# Altium project AnalogHeart.PrjPcb
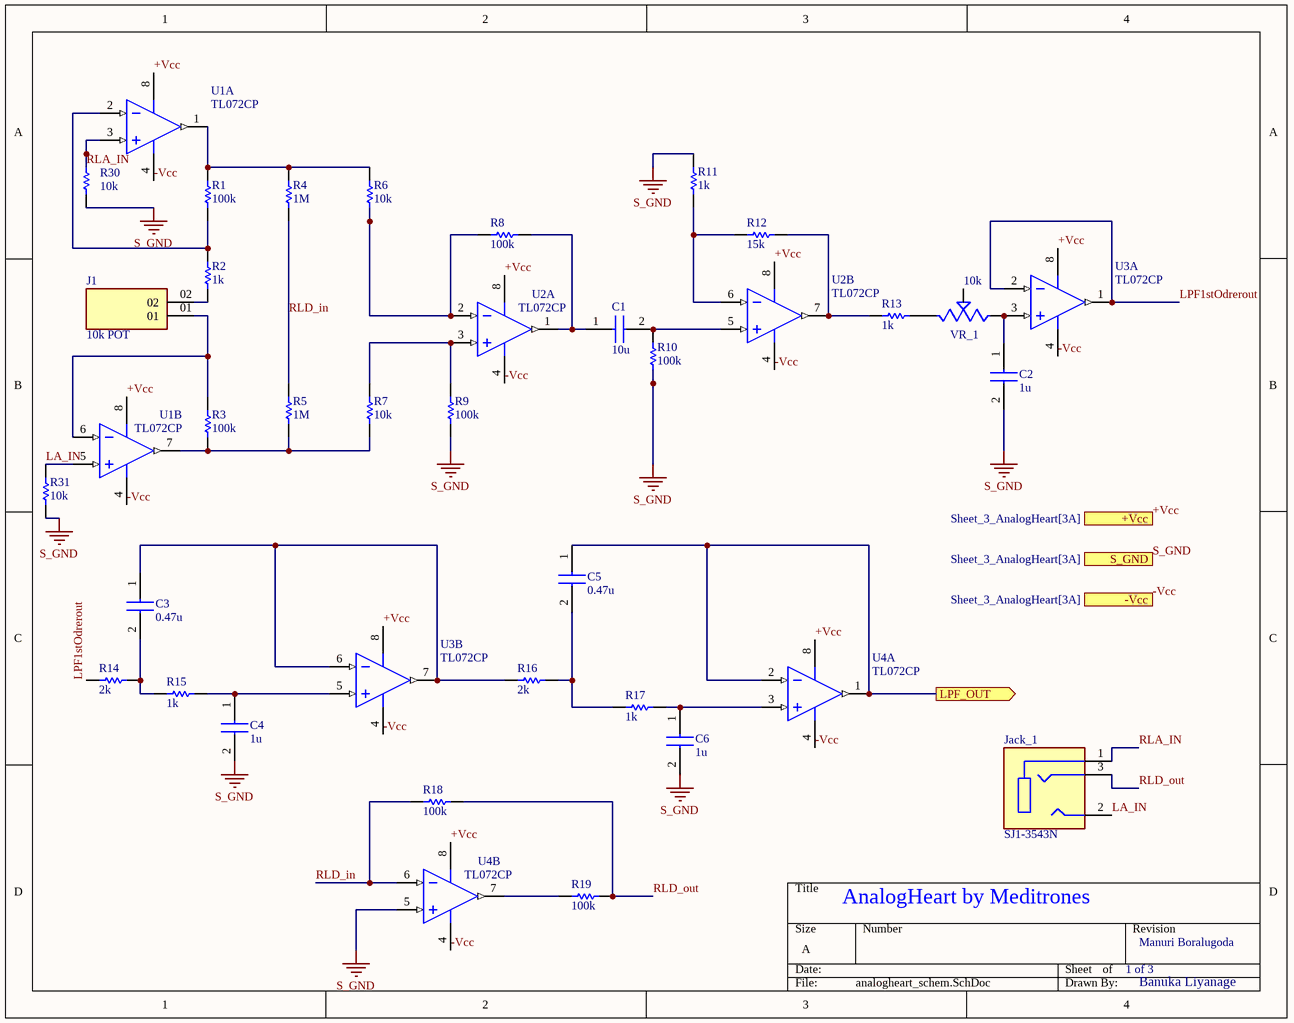
[diagram p0: analogheart_schem.SchDoc]
3 sheets, 72 parts. Net scope: flat (ports and power ports of the same name join across sheets).
Sheets:
  analogheart_schem.SchDoc
  sheet_2_AnalogHeart.SchDoc
  Sheet_3_AnalogHeart.SchDoc

## Sheet analogheart_schem.SchDoc
size A; SheetNumber: 1; SheetTotal: 3

### Parts
C1  10u  [CAPC2012X94N]
C2  1u  [CAPC2012X94N]
C3  0.47u  [CAPC2012X94N]
C4  1u  [CAPC2012X94N]
C5  0.47u  [CAPC2012X94N]
C6  1u  [CAPC2012X94N]
J1  10k POT  [SAMTEC_MTSW-102-11-T-S-640]
Jack_1  SJ1-3543N  [CUI_SJ1-3543N]
R1  100k  [RESC2013X50X30NL20T20]
R2  1k  [RESC2013X50X30NL20T20]
R3  100k  [RESC2013X50X30NL20T20]
R4  1M  [RESC2013X50X30NL20T20]
R5  1M  [RESC2013X50X30NL20T20]
R6  10k  [RESC2013X50X30NL20T20]
R7  10k  [RESC2013X50X30NL20T20]
R8  100k  [RESC2013X50X30NL20T20]
R9  100k  [RESC2013X50X30NL20T20]
R10  100k  [RESC2013X50X30NL20T20]
R11  1k  [RESC2013X50X30NL20T20]
R12  15k  [RESC2013X50X30NL20T20]
R13  1k  [RESC2013X50X30NL20T20]
R14  2k  [RESC2013X50X30NL20T20]
R15  1k  [RESC2013X50X30NL20T20]
R16  2k  [RESC2013X50X30NL20T20]
R17  1k  [RESC2013X50X30NL20T20]
R18  100k  [RESC2013X50X30NL20T20]
R19  100k  [RESC2013X50X30NL20T20]
R30  10k  [RESC2013X50X30NL20T20]
R31  10k  [RESC2013X50X30NL20T20]
U1  TL072CP  [P0008A]  (parts A,B of 2)
U2  TL072CP  [P0008A]  (parts A,B of 2)
U3  TL072CP  [P0008A]  (parts A,B of 2)
U4  TL072CP  [P0008A]  (parts A,B of 2)
VR_1  10k  [TRIM_3386F-1-103TLF]

### Ports
+Vcc (in, see Sheet_3_AnalogHeart[3A]), -Vcc (in, see Sheet_3_AnalogHeart[3A]), LPF_OUT (out, see sheet_2_AnalogHeart[1C]), S_GND (in, see Sheet_3_AnalogHeart[3A])

### Nets
S_GND: C2.2 C4.2 C6.2 R9.1 R10.1 R11.2 R30.2 R31.2 U4.5(IN2+) ; port S_GND
+Vcc: U1.8(VCC+) U2.8(VCC+) U3.8(VCC+) U4.8(VCC+) ; port +Vcc
-Vcc: U1.4(VCC-) U2.4(VCC-) U3.4(VCC-) U4.4(VCC-) ; port -Vcc
LA_IN: Jack_1.2 R31.1 U1.5(IN2+)
LPF1stOdrerout: R14.2 U3.1(OUT1) U3.2(IN1-)
RLA_IN: Jack_1.1 R30.1 U1.3(IN1+)
RLD_in: R4.1 R5.2 R18.2 U4.6(IN2-)
RLD_out: Jack_1.3 R18.1 R19.1
NetC1_1: C1.1 R8.2 U2.1(OUT1)
NetC1_2: C1.2 R10.2 U2.5(IN2+)
NetC2_1: C2.1 U3.3(IN1+) VR_1.1(CCW)
NetC3_1: C3.1 R16.2 U3.6(IN2-) U3.7(OUT2)
NetC3_2: C3.2 R14.1 R15.2
NetC4_1: C4.1 R15.1 U3.5(IN2+)
NetC5_1: C5.1 U4.1(OUT1) U4.2(IN1-) ; port LPF_OUT
NetC5_2: C5.2 R16.1 R17.2
NetC6_1: C6.1 R17.1 U4.3(IN1+)
NetJ1_01: J1.01 R3.2 U1.6(IN2-)
NetJ1_02: J1.02 R2.1
NetR1_1: R1.1 R2.2 U1.2(IN1-)
NetR1_2: R1.2 R4.2 R6.2 U1.1(OUT1)
NetR3_1: R3.1 R5.1 R7.1 U1.7(OUT2)
NetR6_1: R6.1 R8.1 U2.2(IN1-)
NetR7_2: R7.2 R9.2 U2.3(IN1+)
NetR11_1: R11.1 R12.2 U2.6(IN2-)
NetR12_1: R12.1 R13.2 U2.7(OUT2)
NetR13_1: R13.1 VR_1.3(CW)
NetR19_2: R19.2 U4.7(OUT2)

Not connected (* = marked no-connect by the designer): VR_1 2(WIPER)

### Notes on the sheet
- AnalogHeart by Meditrones
- 1 of 3
- Manuri Boralugoda
- Banuka Liyanage

### Library data of the parts
C1-C6 = 08055A331FAT2A: Capacitor; Manufacturer_Name: Kyocera AVX; Datasheet Link: https://componentsearchengine.com/Datasheets/1/06031A100FAT2A.pdf; Height: 0.94mm; Manufacturer_Part_Number: 08055A331FAT2A; Mouser Part Number: 581-08055A331FAT2A; Mouser Price/Stock: https://www.mouser.com/Search/Refine.aspx?Keyword=581-08055A331FAT2A; Arrow Part Number: 08055A331FAT2A; Arrow Price/Stock: https://www.arrow.com/en/products/08055a331fat2a/avx
J1 = MTSW-102-11-T-S-640: Package: None; Price: None; MP: MTSW-102-11-T-S-640; Availability: Unavailable; Value: *
Jack_1 = SJ1-3543N: MF: {'manufacturer': u'CUI'}; Package: None; Price: None; Value: *; MP: SJ1-3543N; Availability: Unavailable
R1-R19 R30 R31 = CMP-2001-04915-1: Manufacturer: Vishay Dale; Part Number: CRCW080510R0FKEA
U1-U4 = CMP-0017-00950-2: Dual Low-Noise JFET-Input General-Purpose Operational Amplifier, 7 to 36 V, 0 to 70 degC, 8-pin DIP (P8), Pb-Free (RoHS); Manufacturer: Texas Instruments; Sub Family: General Purpose Amplifier, High Supply Voltage Amplifier (>=30V); Total Supply Voltage(Max)(+5V is 5, +/-5V is 10): 36; Slew Rate(Typ)(V/us): 13; Vn at 1kHz(Typ)(nV/rtHz): 18; GBW(Typ)(MHz): 3; CMRR(Min)(dB): 70; Total Supply Voltage(Min)(+5V is 5, +/-5V is 10): 7; Vio (25C)(Max)(mV): 10; Rating: Catalog; IIB(Max)(pA): 200; Iq per channel(Max)(mA): 2.5; Number of Channels: 2; Mounting Technology: Through Hole; ComponentLink3Description: Package Specification; PartNumber: TL072CP; PackageVersion: 4040082/E, 04/2010; Eco-Plan: Pb-Free (RoHS); DatasheetVersion: SLOS080J; Offset Drift(Typ)(uV/C): 18; ComponentLink3URL: http://www.ti.com/litv/pdf/mpdi001b; PackageDescription: 8-Pin Plastic In-Line, Body 9.59 x 6.35 mm, Pitch 2.54 mm; Code_JEDEC: MS-001; ComponentLink2URL: http://www.ti.com/lit/ds/symlink/tl072.pdf; ComponentLink1Description: Manufacturer URL; ComponentLink2Description: Datasheet; ComponentLink1URL: http://www.ti.com/; PackageReference: P0008A
VR_1 = 3386F-1-103TLF: 10 kOhms 0.5W, 1/2W PC Pins Through Hole Trimmer Potentiometer Cermet 1.0 Turn Top Finger Adjustment; MF: Bourns; Package: 3386F-3 Bourns; Price: None; Check_prices: https://www.snapeda.com/parts/3386F-1-103TLF/Bourns/view-part/?ref=eda; Value: *; SnapEDA_Link: https://www.snapeda.com/parts/3386F-1-103TLF/Bourns/view-part/?ref=snap; MP: 3386F-1-103TLF; Availability: In Stock; Purchase-URL: https://pricing.snapeda.com/search/part/3386F-1-103TLF/?ref=eda

## Sheet sheet_2_AnalogHeart.SchDoc
size A; SheetNumber: 2; SheetTotal: 3
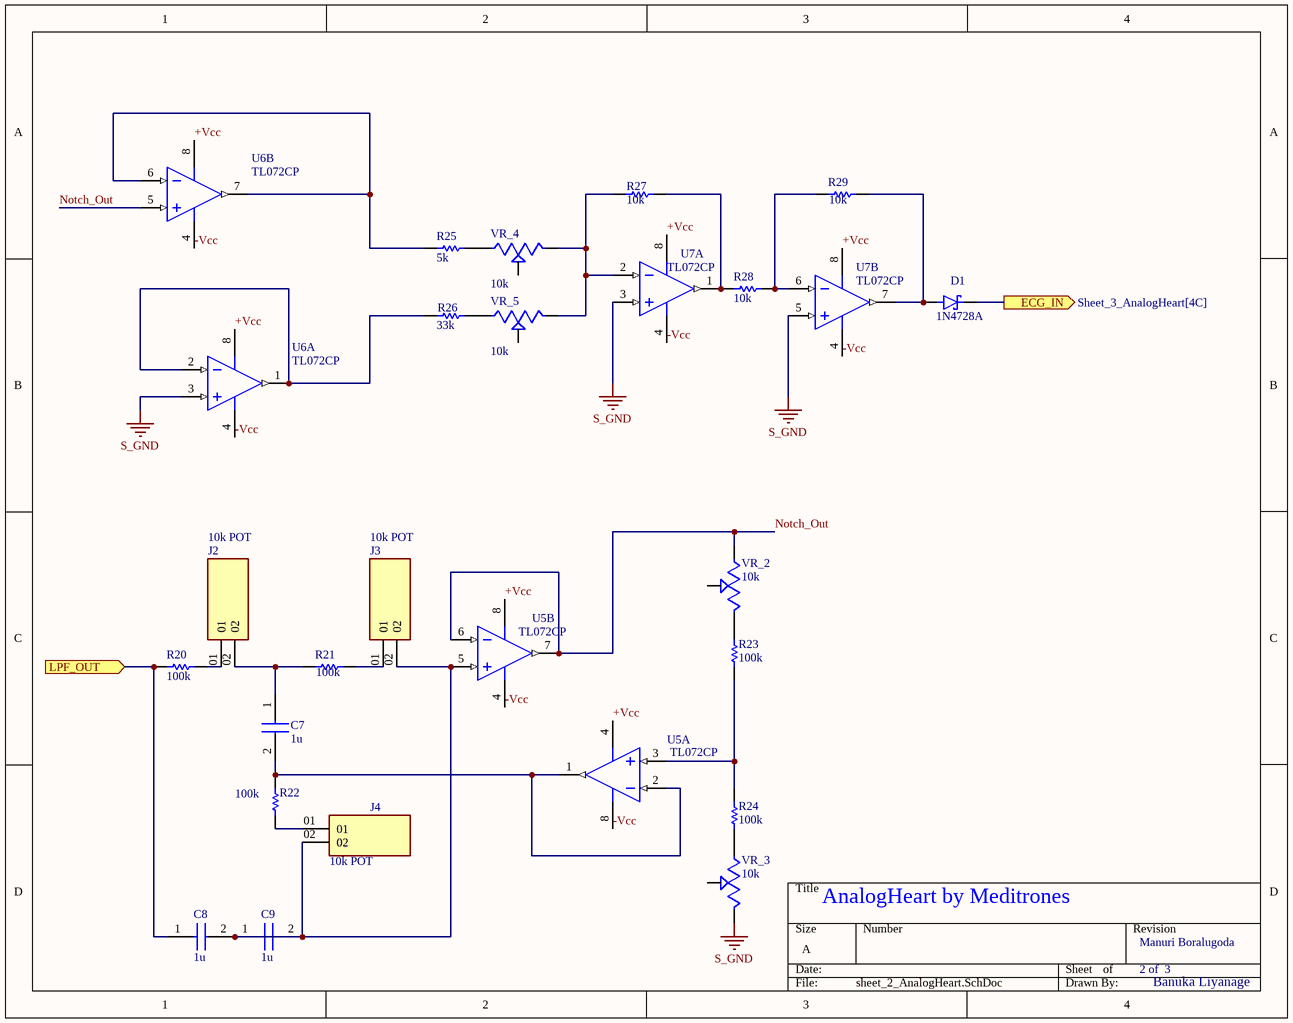
[diagram p1: sheet_2_AnalogHeart.SchDoc]

### Parts
C7  1u  [CAPC2012X94N]
C8  1u  [CAPC2012X94N]
C9  1u  [CAPC2012X94N]
D1  1N4728A  [DIOAD1036W78L463D272]
J2  10k POT  [SAMTEC_MTSW-102-11-T-S-640]
J3  10k POT  [SAMTEC_MTSW-102-11-T-S-640]
J4  10k POT  [SAMTEC_MTSW-102-11-T-S-640]
R20  100k  [RESC2013X50X30NL20T20]
R21  100k  [RESC2013X50X30NL20T20]
R22  100k  [RESC2013X50X30NL20T20]
R23  100k  [RESC2013X50X30NL20T20]
R24  100k  [RESC2013X50X30NL20T20]
R25  5k  [RESC2013X50X30NL20T20]
R26  33k  [RESC2013X50X30NL20T20]
R27  10k  [RESC2013X50X30NL20T20]
R28  10k  [RESC2013X50X30NL20T20]
R29  10k  [RESC2013X50X30NL20T20]
U5  TL072CP  [P0008A]  (parts A,B of 2)
U6  TL072CP  [P0008A]  (parts A,B of 2)
U7  TL072CP  [P0008A]  (parts A,B of 2)
VR_2  10k  [TRIM_3386F-1-103TLF]
VR_3  10k  [TRIM_3386F-1-103TLF]
VR_4  10k  [TRIM_3386F-1-103TLF]
VR_5  10k  [TRIM_3386F-1-103TLF]

### Ports
ECG_IN (out, see Sheet_3_AnalogHeart[4C]), LPF_OUT (in, see analogheart_schem[3C])

### Nets
S_GND: U6.3(IN1+) U7.3(IN1+) U7.5(IN2+) VR_3.3(CW)
+Vcc: U5.4(VCC-) U5.8(VCC+) U6.8(VCC+) U7.8(VCC+)
-Vcc: U5.4(VCC-) U5.8(VCC+) U6.4(VCC-) U7.4(VCC-)
Notch_Out: U5.6(IN2-) U5.7(OUT2) U6.5(IN2+) VR_2.1(CCW)
NetC5_1: C8.1 R20.2 ; port LPF_OUT
NetC7_1: C7.1 J2.02 R21.2
NetC7_2: C7.2 R22.1 U5.1(OUT1) U5.2(IN1-)
NetC8_2: C8.2 C9.1 C9.2 J3.02 J4.02 U5.5(IN2+)
NetD1_1: D1.1(K) ; port ECG_IN
NetD1_2: D1.2(A) R29.1 U7.7(OUT2)
NetJ2_01: J2.01 R20.1
NetJ3_01: J3.01 R21.1
NetJ4_01: J4.01 R22.2
NetR23_1: R23.1 VR_2.3(CW)
NetR23_2: R23.2 R24.1 U5.3(IN1+)
NetR24_2: R24.2 VR_3.1(CCW)
NetR25_1: R25.1 VR_4.1(CCW)
NetR25_2: R25.2 U6.6(IN2-) U6.7(OUT2)
NetR26_1: R26.1 VR_5.1(CCW)
NetR26_2: R26.2 U6.1(OUT1) U6.2(IN1-)
NetR27_1: R27.1 R28.2 U7.1(OUT1)
NetR27_2: R27.2 U7.2(IN1-) VR_4.3(CW) VR_5.3(CW)
NetR28_1: R28.1 R29.2 U7.6(IN2-)

Not connected (* = marked no-connect by the designer): VR_2 2(WIPER); VR_3 2(WIPER); VR_4 2(WIPER); VR_5 2(WIPER)

### Notes on the sheet
- AnalogHeart by Meditrones
- 2 of  3
- Manuri Boralugoda
- Banuka Liyanage

### Library data of the parts
C7-C9 = 08055A331FAT2A: as C1 on sheet analogheart_schem; Datasheet Link: https://componentsearchengine.com/Datasheets/1/06031A100FAT2A.pdf; Height: 0.94mm; Manufacturer_Part_Number: 08055A331FAT2A; Mouser Part Number: 581-08055A331FAT2A; Mouser Price/Stock: https://www.mouser.com/Search/Refine.aspx?Keyword=581-08055A331FAT2A; Arrow Part Number: 08055A331FAT2A; Arrow Price/Stock: https://www.arrow.com/en/products/08055a331fat2a/avx
D1 = 1N4728A: Ð¡Ñ‚Ð°Ð±Ð¸Ð»Ð¸Ñ‚Ñ€Ð¾Ð½ 3,3 Ð’ 1 Ð’Ñ‚ Â± 5% ÑÐ¾ ÑÐºÐ²Ð¾Ð·Ð½Ñ‹Ð¼ Ð¾Ñ‚Ð²ÐµÑ€ÑÑ‚Ð¸ÐµÐ¼ DO-41; MF: ON Semiconductor; SnapEDA_Link: https://www.snapeda.com/parts/1N4728A/Onsemi/view-part/?ref=snap; Package: DO-41 ON Semiconductor; Value: *; MP: 1N4728A; Check_prices: https://www.snapeda.com/parts/1N4728A/Onsemi/view-part/?ref=eda
J2-J4 = MTSW-102-11-T-S-640: Package: None; Price: None; MP: MTSW-102-11-T-S-640; Availability: Unavailable; Value: *
R20-R29 = CMP-2001-04915-1: as R1 on sheet analogheart_schem
U5-U7 = CMP-0017-00950-2: as U1 on sheet analogheart_schem; Mounting Technology: Through Hole; ComponentLink3Description: Package Specification; PartNumber: TL072CP; PackageVersion: 4040082/E, 04/2010; Eco-Plan: Pb-Free (RoHS); DatasheetVersion: SLOS080J; Offset Drift(Typ)(uV/C): 18; ComponentLink3URL: http://www.ti.com/litv/pdf/mpdi001b; PackageDescription: 8-Pin Plastic In-Line, Body 9.59 x 6.35 mm, Pitch 2.54 mm; Code_JEDEC: MS-001; ComponentLink2URL: http://www.ti.com/lit/ds/symlink/tl072.pdf; ComponentLink1Description: Manufacturer URL; ComponentLink2Description: Datasheet; ComponentLink1URL: http://www.ti.com/; PackageReference: P0008A
VR_2-VR_5 = 3386F-1-103TLF: as VR_1 on sheet analogheart_schem; Package: 3386F-3 Bourns; Price: None; Check_prices: https://www.snapeda.com/parts/3386F-1-103TLF/Bourns/view-part/?ref=eda; Value: *; SnapEDA_Link: https://www.snapeda.com/parts/3386F-1-103TLF/Bourns/view-part/?ref=snap; MP: 3386F-1-103TLF; Availability: In Stock; Purchase-URL: https://pricing.snapeda.com/search/part/3386F-1-103TLF/?ref=eda

## Sheet Sheet_3_AnalogHeart.SchDoc
size A; SheetNumber: 3; SheetTotal: 3
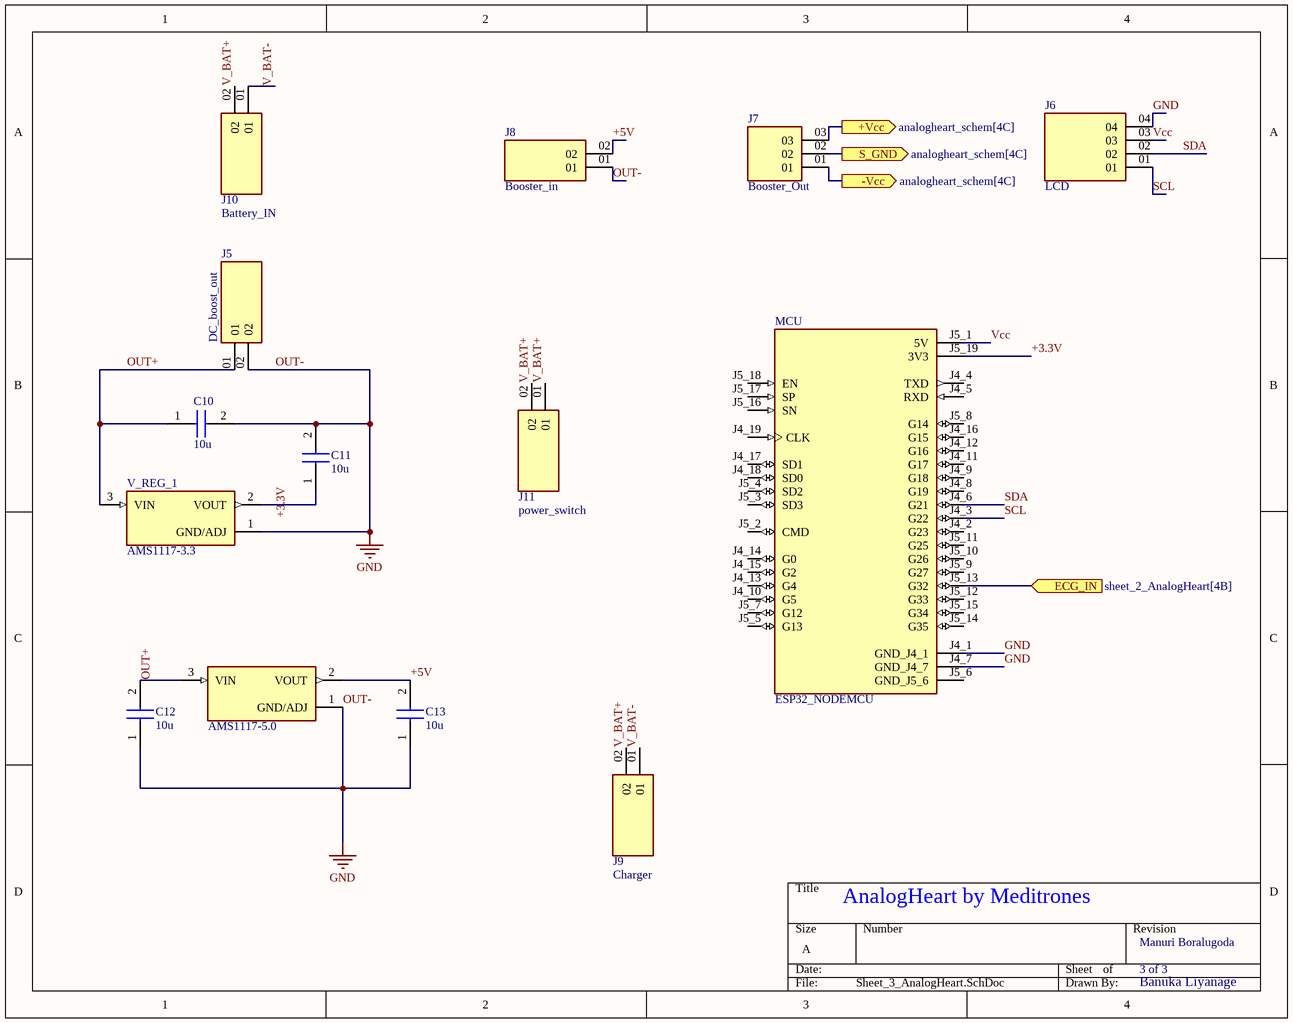
[diagram p2: Sheet_3_AnalogHeart.SchDoc]

### Parts
?  AMS1117-5.0  [SOT229P700X180-4N]
C10  10u  [CAPC2012X94N]
C11  10u  [CAPC2012X94N]
C12  10u  [CAPC2012X94N]
C13  10u  [CAPC2012X94N]
J5  DC_boost_out  [SAMTEC_MTSW-102-11-T-S-640]
J6  LCD  [SAMTEC_MTSW-104-08-G-S-350]
J7  Booster_Out  [SAMTEC_MTLW-103-XX-XX-S-XXX]
J8  Booster_in  [SAMTEC_MTSW-102-11-T-S-640]
J9  Charger  [SAMTEC_MTSW-102-11-T-S-640]
J10  Battery_IN  [SAMTEC_MTSW-102-11-T-S-640]
J11  power_switch  [SAMTEC_MTSW-102-11-T-S-640]
MCU  ESP32_NODEMCU  [MODULE_ESP32_NODEMCU]
V_REG_1  AMS1117-3.3  [SOT229P700X180-4N]

### Ports
+Vcc (out, see analogheart_schem[4C]), -Vcc (out, see analogheart_schem[4C]), ECG_IN (in, see sheet_2_AnalogHeart[4B]), S_GND (out, see analogheart_schem[4C])

### Nets
GND: ?.1(GND/ADJ) C10.2 C11.2 C12.1 C13.1 J5.02 J6.04 J8.01 MCU.J4_1(GND_J4_1) MCU.J4_7(GND_J4_7) V_REG_1.1(GND/ADJ)  [also labelled OUT-]
S_GND: J7.02 ; port S_GND
+3.3V: MCU.J5_19(3V3)
+5V: ?.2(VOUT) C13.2 J8.02
+Vcc: J7.03 ; port +Vcc
-Vcc: J7.01 ; port -Vcc
OUT+: ?.3(VIN) C10.1 C12.2 J5.01 V_REG_1.3(VIN)
SCL: J6.01 MCU.J4_3(G22)
SDA: J6.02 MCU.J4_6(G21)
V_BAT+: J9.02 J10.02 J11.01 J11.02
V_BAT-: J9.01 J10.01
Vcc: J6.03 MCU.J5_1(5V)
NetC11_1: C11.1 V_REG_1.2(VOUT)
NetD1_1: MCU.J5_13(G32) ; port ECG_IN

Not connected (* = marked no-connect by the designer): MCU J4_2(G23) J4_4(TXD) J4_5(RXD) J4_8(G19) J4_9(G18) J4_10(G5) J4_11(G17) J4_12(G16) J4_13(G4) J4_14(G0) J4_15(G2) J4_16(G15) J4_17(SD1) J4_18(SD0) J4_19(CLK) J5_2(CMD) J5_3(SD3) J5_4(SD2) J5_5(G13) J5_6(GND_J5_6) J5_7(G12) J5_8(G14) J5_9(G27) J5_10(G26) J5_11(G25) J5_12(G33) J5_14(G35) J5_15(G34) J5_16(SN) J5_17(SP) J5_18(EN)

### Notes on the sheet
- AnalogHeart by Meditrones
- 3 of 3
- Manuri Boralugoda
- Banuka Liyanage
- Labels drawn without touching a wire or pin: +3.3V

### Library data of the parts
? = AMS1117-5.0: 1A LOW DROPOUT VOLTAGE REGULATOR; MF: ams; MP: AMS1117-5.0; Package: SOT-223 Seeed Technology; SnapEDA_Link: https://www.snapeda.com/parts/AMS1117-5.0/ams/view-part/?ref=snap; Check_prices: https://www.snapeda.com/parts/AMS1117-5.0/ams/view-part/?ref=eda; Availability: Not in stock; Value: *; Price: None
C10-C13 = 08055A331FAT2A: as C1 on sheet analogheart_schem; Datasheet Link: https://componentsearchengine.com/Datasheets/1/06031A100FAT2A.pdf; Height: 0.94mm; Manufacturer_Part_Number: 08055A331FAT2A; Mouser Part Number: 581-08055A331FAT2A; Mouser Price/Stock: https://www.mouser.com/Search/Refine.aspx?Keyword=581-08055A331FAT2A; Arrow Part Number: 08055A331FAT2A; Arrow Price/Stock: https://www.arrow.com/en/products/08055a331fat2a/avx
J5 J8-J11 = MTSW-102-11-T-S-640: Package: None; Price: None; MP: MTSW-102-11-T-S-640; Availability: Unavailable; Value: *
J6 = MTSW-104-08-G-S-350: CONN HEADER VERT 4POS 2.54MM; MF: Samtec; SnapEDA_Link: https://www.snapeda.com/parts/MTSW-104-08-G-S-350/Samtec/view-part/?ref=snap; Package: None; Value: *; MP: MTSW-104-08-G-S-350; Check_prices: https://www.snapeda.com/parts/MTSW-104-08-G-S-350/Samtec/view-part/?ref=eda
J7 = MTLW-103-XX-XX-S-XXX: Connector Header Through Hole 40 position 0.100" (2.54mm); Package: None; Price: None; Value: *; MP: MTLW-103-XX-XX-S-XXX; Availability: Unavailable
MCU = ESP32_NODEMCU: NodeMCU is an open source loT platform. ESP32 is a series of low cost, low powersystem-on-chip (SoC) microcontrollers with integrated Wi-Fi & dual-mode Bluetooth.; MF: Espressif Systems; MP: ESP32 NODEMCU; SnapEDA_Link: https://www.snapeda.com/parts/ESP32%20NODEMCU/Espressif+Systems/view-part/?ref=snap; Package: Package; Value: *; Check_prices: https://www.snapeda.com/parts/ESP32%20NODEMCU/Espressif+Systems/view-part/?ref=eda
V_REG_1 = AMS1117-3.3: Sot223/Pkg 1-Amp 3.3-Volt Low Drop Out Voltage Regulatator; MF: Advanced Monolithic Systems; Package: SOT-223 Seeed Technology; Value: *; Check_prices: https://www.snapeda.com/parts/AMS1117-3.3/Advanced+Monolithic+Systems/view-part/?ref=eda; Price: None; Availability: Not in stock; MP: AMS1117-3.3; SnapEDA_Link: https://www.snapeda.com/parts/AMS1117-3.3/Advanced+Monolithic+Systems/view-part/?ref=snap

## Nets that join several sheets
S_GND: analogheart_schem (9 pins), sheet_2_AnalogHeart (U6.3 U7.3 U7.5 VR_3.3), Sheet_3_AnalogHeart (J7.02)
+Vcc: analogheart_schem (U1.8 U2.8 U3.8 U4.8), Sheet_3_AnalogHeart (J7.03)
-Vcc: analogheart_schem (U1.4 U2.4 U3.4 U4.4), Sheet_3_AnalogHeart (J7.01)
NetC5_1: analogheart_schem (C5.1 U4.1 U4.2), sheet_2_AnalogHeart (C8.1 R20.2)
NetD1_1: sheet_2_AnalogHeart (D1.1), Sheet_3_AnalogHeart (MCU.J5_13)